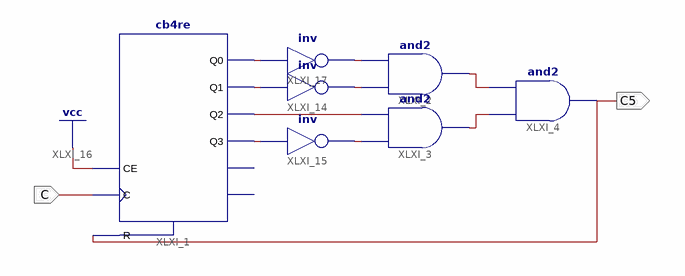
[diagram p0: schematic sheet 1]
// Xilinx ISE schematic contador5.sch (spartan3e) as structural Verilog: 7 symbols, 2 ports
module contador5 (
  input  C,
  output C5
);

  wire XLXN_3, XLXN_4, XLXN_16, XLXN_18, XLXN_19, XLXN_20, XLXN_21, XLXN_23, XLXN_24;

  cb4re XLXI_1 (.C(C), .CE(1'b1), .R(C5), .Q0(XLXN_23), .Q1(XLXN_21), .Q2(XLXN_16), .Q3(XLXN_18));  // open: CEO, TC
  and XLXI_2 (XLXN_3, XLXN_20, XLXN_24);
  and XLXI_3 (XLXN_4, XLXN_19, XLXN_16);
  and XLXI_4 (C5, XLXN_4, XLXN_3);
  not XLXI_15 (XLXN_19, XLXN_18);
  not XLXI_14 (XLXN_20, XLXN_21);
  not XLXI_17 (XLXN_24, XLXN_23);
endmodule
